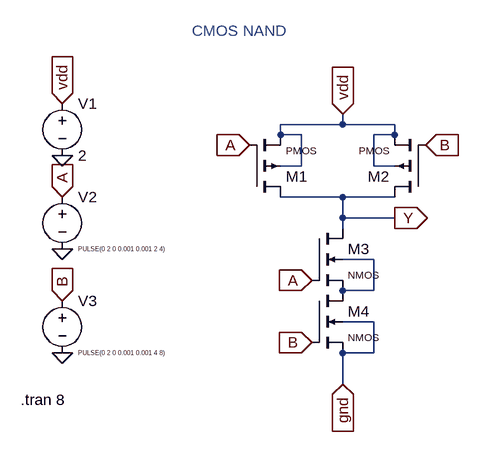
[diagram p0: schematic CMOS NAND.asc]
CMOS NAND.asc, the LTspice schematic file:
Version 4
SHEET 1 880 680
WIRE 256 16 256 0
WIRE 256 16 160 16
WIRE 336 16 256 16
WIRE 160 32 160 16
WIRE 192 32 160 32
WIRE 336 32 336 16
WIRE 336 32 304 32
WIRE 192 80 192 32
WIRE 192 80 160 80
WIRE 304 80 304 32
WIRE 336 80 304 80
WIRE 256 128 160 128
WIRE 336 128 256 128
WIRE 256 160 256 128
WIRE 336 160 256 160
WIRE 256 176 256 160
WIRE 304 224 256 224
WIRE 304 272 304 224
WIRE 304 272 256 272
WIRE 304 320 256 320
WIRE 304 368 304 320
WIRE 304 368 256 368
WIRE 256 416 256 368
FLAG 256 0 vdd
IOPIN 256 0 In
FLAG -176 -16 vdd
IOPIN -176 -16 In
FLAG 112 48 A
IOPIN 112 48 In
FLAG -176 128 A
IOPIN -176 128 In
FLAG 208 256 A
IOPIN 208 256 In
FLAG 208 352 B
IOPIN 208 352 In
FLAG -176 288 B
IOPIN -176 288 In
FLAG 384 48 B
IOPIN 384 48 In
FLAG -176 64 0
FLAG -176 208 0
FLAG -176 368 0
FLAG 336 160 Y
IOPIN 336 160 Out
FLAG 256 416 gnd
IOPIN 256 416 In
SYMBOL pmos4 112 128 M180
WINDOW 3 56 72 Left 1
SYMATTR InstName M1
SYMBOL pmos4 384 128 R180
WINDOW 3 56 72 Left 1
SYMATTR InstName M2
SYMBOL nmos4 208 176 R0
WINDOW 3 56 72 Left 1
SYMATTR InstName M3
SYMBOL nmos4 208 272 R0
WINDOW 3 56 72 Left 1
SYMATTR InstName M4
SYMBOL voltage -176 -32 R0
WINDOW 123 0 0 Left 0
WINDOW 39 0 0 Left 0
SYMATTR InstName V1
SYMATTR Value 2
SYMBOL voltage -176 112 R0
WINDOW 3 24 96 Left 0
WINDOW 123 0 0 Left 0
WINDOW 39 0 0 Left 0
SYMATTR Value PULSE(0 2 0 0.001 0.001 2 4)
SYMATTR InstName V2
SYMBOL voltage -176 272 R0
WINDOW 3 24 96 Left 0
WINDOW 123 0 0 Left 0
WINDOW 39 0 0 Left 0
SYMATTR Value PULSE(0 2 0 0.001 0.001 4 8)
SYMATTR InstName V3
TEXT -240 440 Left 2 !.tran 8
TEXT 24 -128 Left 2 ;CMOS NAND

The netlist it stands for:
* CMOS NAND.asc
M1 Y A vdd vdd PMOS
M2 Y B vdd vdd PMOS
M3 Y A N001 N001 NMOS
M4 N001 B gnd gnd NMOS
V1 vdd 0 2
V2 A 0 PULSE(0 2 0 0.001 0.001 2 4)
V3 B 0 PULSE(0 2 0 0.001 0.001 4 8)
.model NMOS NMOS
.model PMOS PMOS
.lib standard.mos
.tran 8
* CMOS NAND
.backanno
.end

* Results of the author's LTspice run, read from the files saved beside the schematic
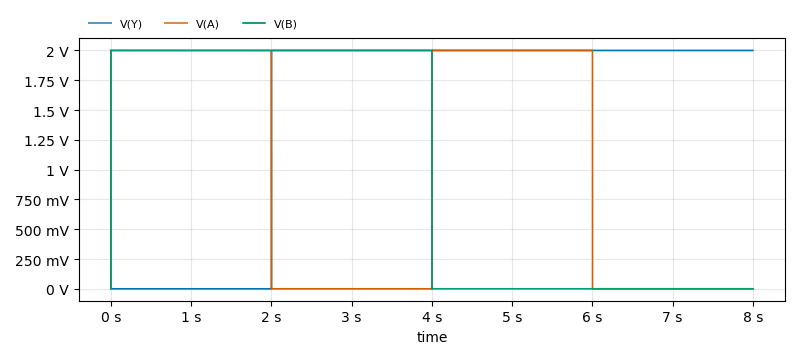
[diagram p1: Transient Analysis of CMOS NAND.asc, plotted from the saved traces]
* Transient Analysis, 1 run:
*   V(Y): min 400.9 nV, max 2.001 V, average 1.5 V, rms 1.732 V, last 2 V
*   V(A): min 0 V, max 2 V, average 1.001 V, rms 1.414 V, last 0 V
*   V(B): min 0 V, max 2 V, average 1 V, rms 1.414 V, last 0 V